# Altium schematic sheet Overview.SchDoc: Overview
size A3; PageSetup: Record=PageOptions|CenterHorizontal=True|CenterVertical=True|PrintScale=1.01|XCorrection=1.00|YCorrection=1.00|PrintKind=2|BorderSize=5000000|LeftOffset=0|BottomOffset=0|Orientation=2|PaperLength=1000|PaperWidth=1000|Scale=100|PaperSource=15|PrintQuality=600|MediaType=1|DitherType=10|PaperKind=A3|PrintScaleMode=1; DocumentNumber: 3; SheetNumber: 1; SheetTotal: 2
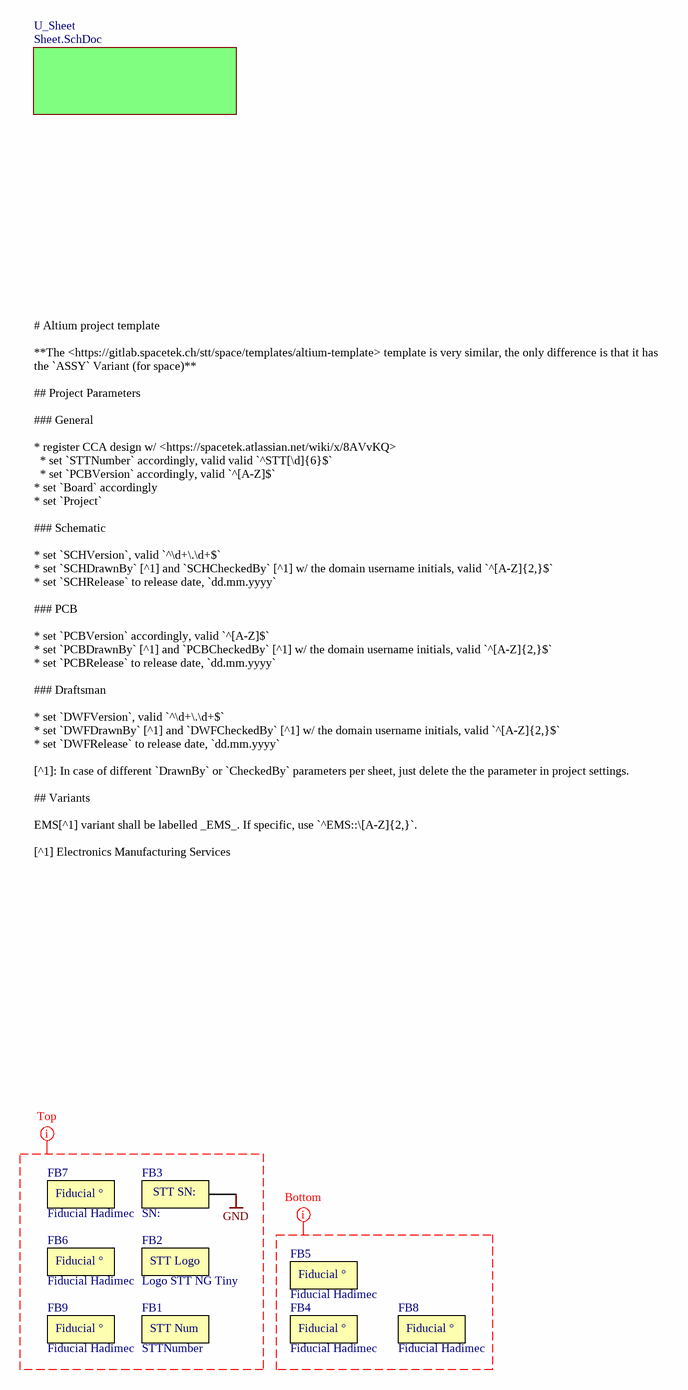
[diagram p0: Overview.SchDoc]

## Parts
FB1  STTNumber  [STT--DO--STT-Number]  (no BOM)
FB2  Logo STT NG Tiny  [STT--DO--Logo-New]
FB3  SN:  [STT--DO--SN]  (no BOM)
FB4  Fiducial Hadimec  [STT--DO--Fiducial-Hadimec]  (no BOM)
FB5  Fiducial Hadimec  [STT--DO--Fiducial-Hadimec]  (no BOM)
FB6  Fiducial Hadimec  [STT--DO--Fiducial-Hadimec]  (no BOM)
FB7  Fiducial Hadimec  [STT--DO--Fiducial-Hadimec]  (no BOM)
FB8  Fiducial Hadimec  [STT--DO--Fiducial-Hadimec]  (no BOM)
FB9  Fiducial Hadimec  [STT--DO--Fiducial-Hadimec]  (no BOM)

## Sub-sheets
U_Sheet = Sheet.SchDoc: no entries

## Nets
GND: FB3.1

## Layout directives
rule Permitted Layers Rule [Permitted Layers - Top,]: GND
rule Permitted Layers Rule [Permitted Layers - Bottom]: (no net found under the mark)

## Notes on the sheet
- # Altium project template
  **The <https://gitlab.spacetek.ch/stt/space/templates/altium-template> template is very similar, the only difference is that it has the `ASSY` Variant (for space)**
  ## Project Parameters
  ### General
  * register CCA design w/ <https://spacetek.atlassian.net/wiki/x/8AVvKQ>
  * set `STTNumber` accordingly, valid valid `^STT[\d]{6}$`
  * set `PCBVersion` accordingly, valid `^[A-Z]$`
  * set `Board` accordingly
  * set `Project`
  ### Schematic
  * set `SCHVersion`, valid `^\d+\.\d+$`
  * set `SCHDrawnBy` [^1] and `SCHCheckedBy` [^1] w/ the domain username initials, valid `^[A-Z]{2,}$`
  * set `SCHRelease` to release date, `dd.mm.yyyy`
  ### PCB
  * set `PCBVersion` accordingly, valid `^[A-Z]$`
  * set `PCBDrawnBy` [^1] and `PCBCheckedBy` [^1] w/ the domain username initials, valid `^[A-Z]{2,}$`
  * set `PCBRelease` to release date, `dd.mm.yyyy`
  ### Draftsman
  * set `DWFVersion`, valid `^\d+\.\d+$`
  * set `DWFDrawnBy` [^1] and `DWFCheckedBy` [^1] w/ the domain username initials, valid `^[A-Z]{2,}$`
  * set `DWFRelease` to release date, `dd.mm.yyyy`
  [^1]: In case of different `DrawnBy` or `CheckedBy` parameters per sheet, just delete the the parameter in project settings.
  ## Variants
  EMS[^1] variant shall be labelled _EMS_. If specific, use `^EMS::\[A-Z]{2,}`.
  [^1] Electronics Manufacturing Services
- VERTRAULICH   CONFIDENTIAL   Copyright by Spacetek Technology AG. Für dieses Dokument behalten wir uns alle Rechte vor. We reserve all rights in respect of this document.
- Project:
- Number:
- Variant:
- Version:
- Git:
- Board:
- Page:
- Release:
- Size:
- Sheet
- A3
- of
- Design:
- Check:
- File:
- (in symbol 800001-6) STT SN:
- (in symbol 800002-6) STT Num
- (in symbol 800066-3) Fiducial °
- (in symbol CMP-042-000002-2) STT Logo

## Library data of the parts
FB1 = 800002-6: Fabrication Object STTNumber SMD--STTNumber; preferred: Yes; Type: Fabrication Object; Value: STTNumber; Partnumber: STTNumber; Status: active; Package: SMD--STTNumber
FB2 = CMP-042-000002-2: Fabrication Object Logo STT NG SMD--LOGO; A-Number: 800071; Type: Fabrication Object; Partnumber: Logo STT NG Tiny; Status: draft; Value: Logo STT NG Tiny; Package: SMD--LOGO
FB3 = 800001-6: Fabrication Object SN: SMD--SN; A-Number: 800001; preferred: Yes; Value: SN:; Status: active; Partnumber: SN:; Type: Fabrication Object; Package: SMD--SN
FB4-FB9 = 800066-3: Fabrication Object Fiducial Hadimec SMD--Fiducial-point 1.5 / 3mm; A-Number: 800066; preferred: Yes; Status: active; Type: Fabrication Object; Partnumber: Fiducial Hadimec; Value: Fiducial Hadimec; Special: 1.5 / 3mm; Package: SMD--Fiducial-point